# EAGLE board DUINOMITE-eMEGA_Rev_B1 (EAGLE 4.16), part 1 of 2
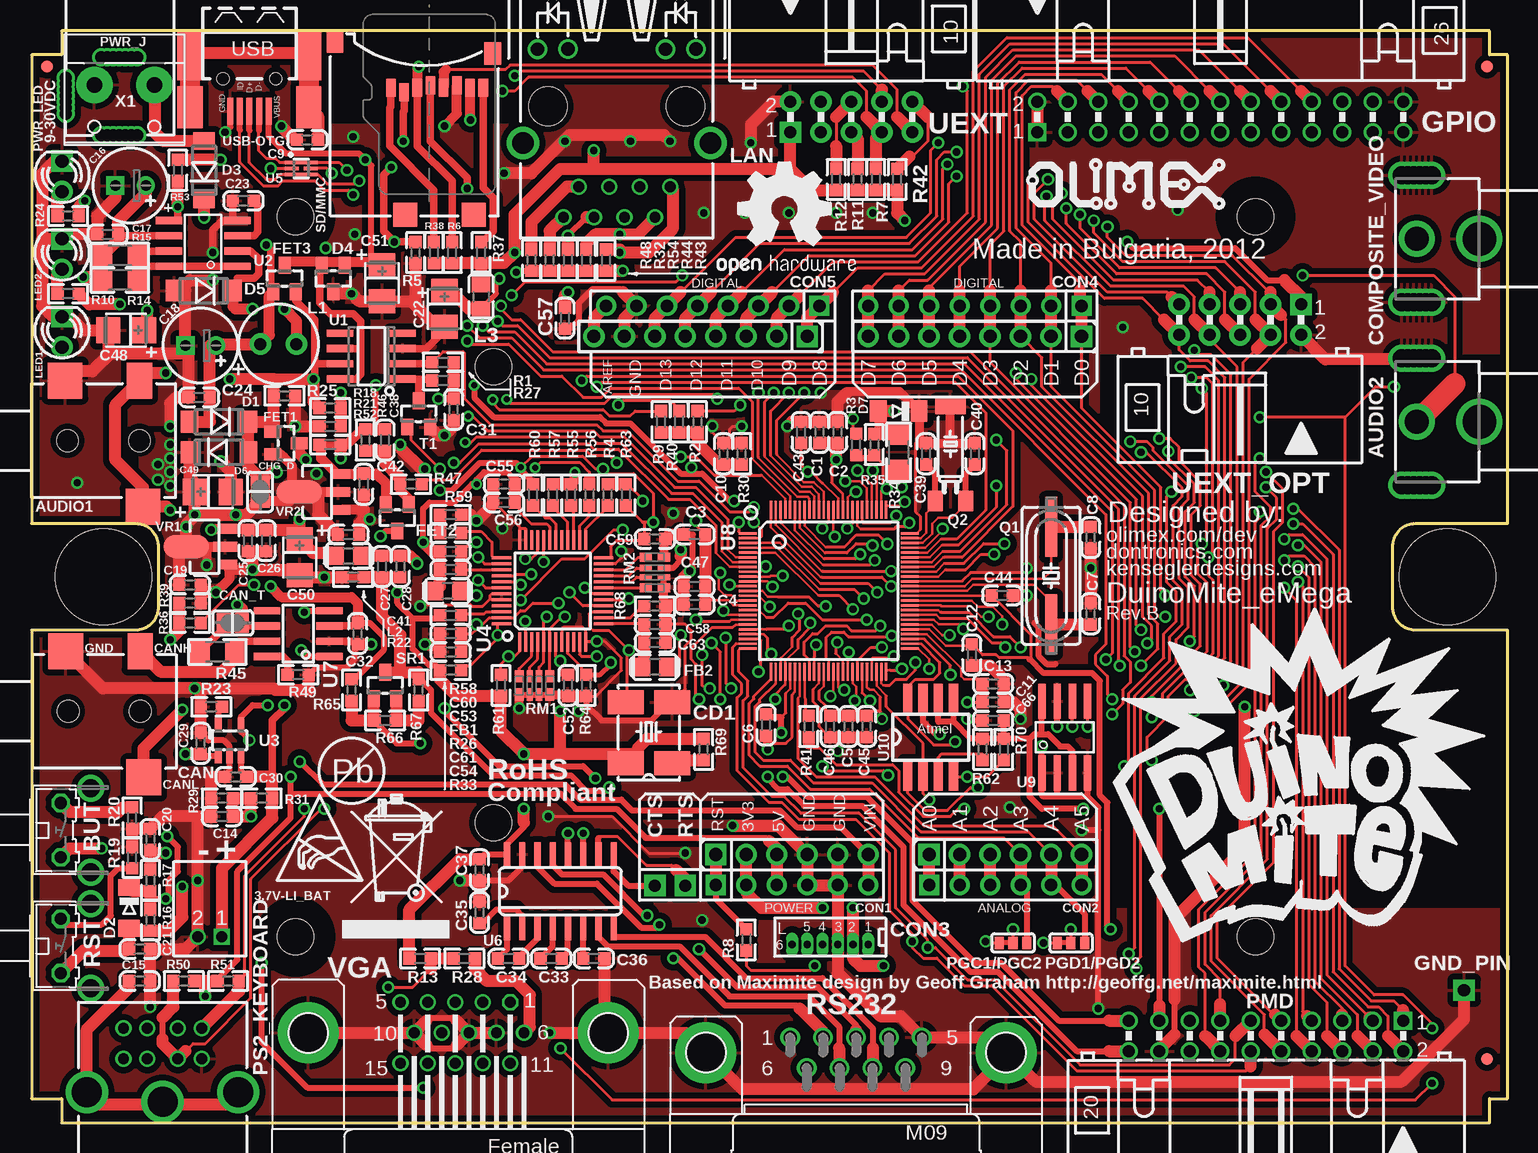
[diagram p2: board, top side]
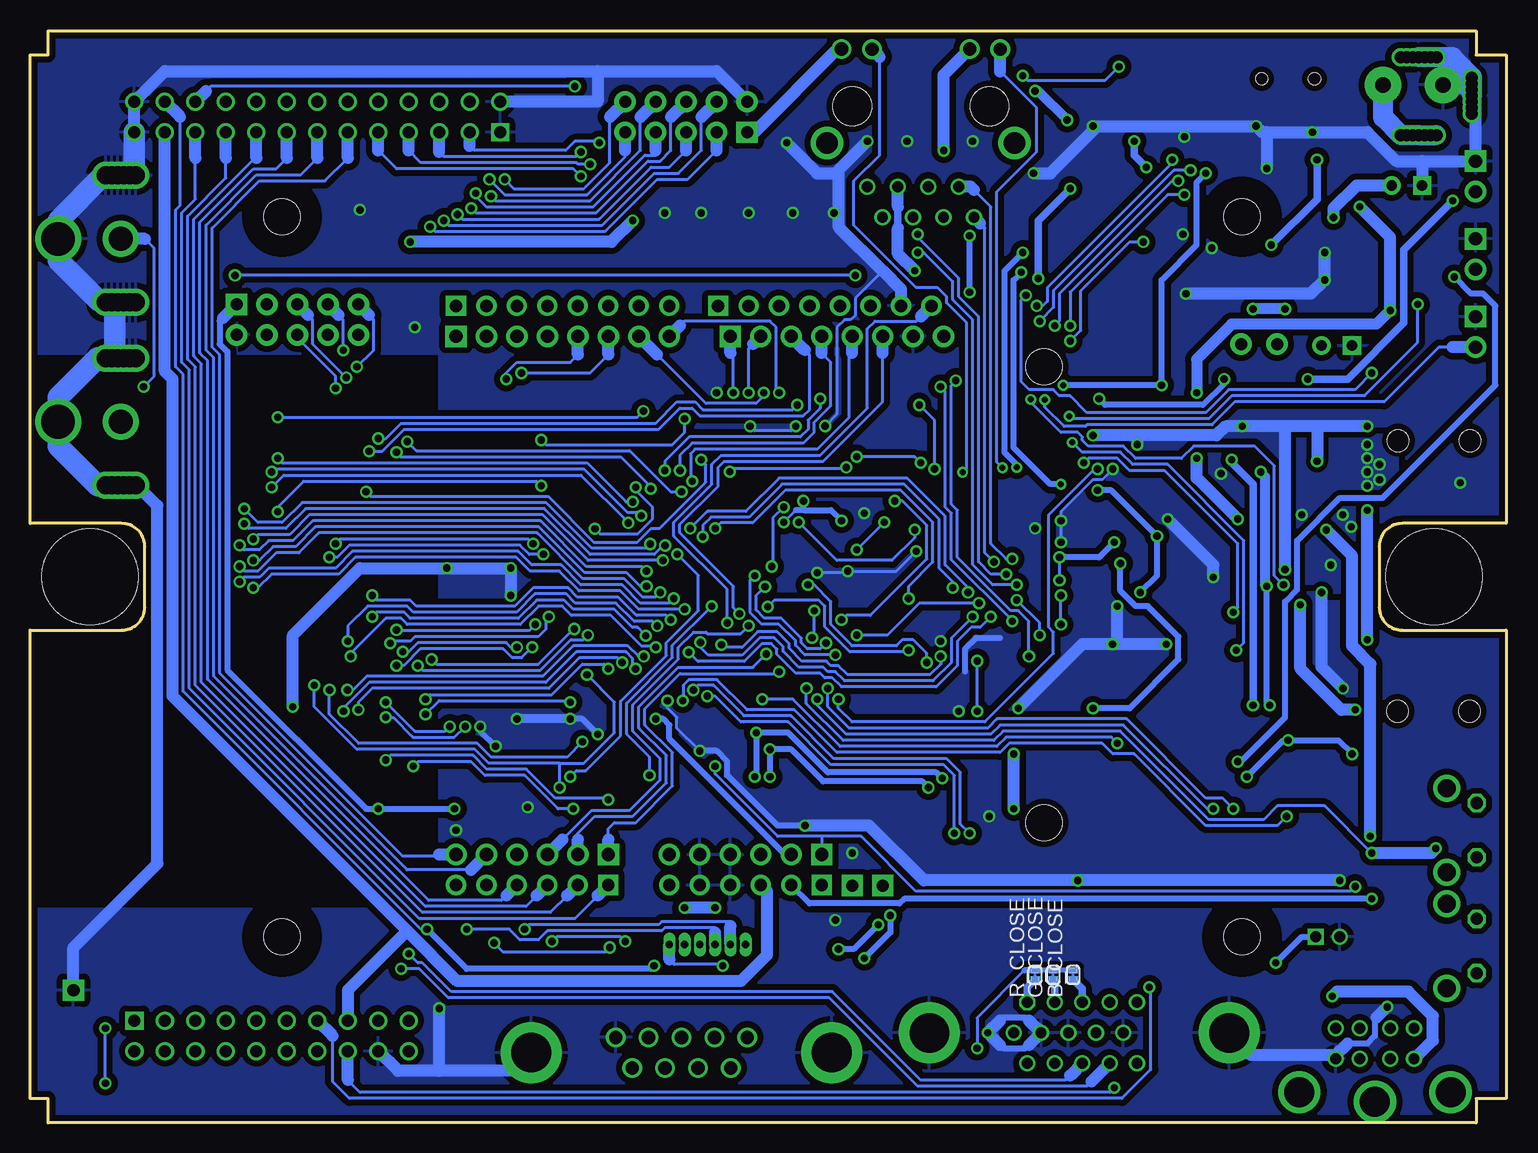
[diagram p3: board, bottom side, seen from below]

Size 123 x 91 mm. Coordinates in mm from the lower left corner, seen from the top.
Copper layers (1+16): Top 0.035mm / dielectric 1.5mm / Bottom 0.035mm
Design rules "default": minimum track width 8mil, minimum drill 0.5mm, track to track 8mil, track to pad 8mil, pad to pad 8mil, via to via 8mil, smd to smd 1mil, copper to edge 10mil, drill to drill 8mil, minimum pad ring 8mil, minimum via ring 8mil, stop-mask expansion 4mil, vias tented up to drill 25mil, thermal gap 20mil
Net classes: 1 pwr: width 0.201 mm, drill 0.201 mm
Holes 3 mm at 38.5,63 38.5,25

## Footprints (pad centres in the part's own frame; a part is rotated, then mirrored left to right if it is on the bottom)
DW02R = drill 0.9 square: 1 -1,0 | drill 0.9 round: 2 1,0
PHONE_JACK-SMD = smd 2.9 x 3: 1 -0.2,5; 5 6.3,-5.5 | smd 2.1 x 3: 2 6,5 | hole 1.8: 0,0; 6,0
VIDEO_CINCH = drill 1.5 pad 1.93 round: GND1 -5.3,-5.475; GND1A -5.3,-3.975; GND1B -5.3,-4.475; GND1C -5.3,-4.975; GND1D -5.3,-5.975; GND1E -5.3,-6.475; GND3 5.3,-5.475; GND3C 5.3,-4.975; GND3D 5.3,-5.975; GND3E 5.3,-6.475; GNG3A 5.3,-3.975; GNG3B 5.3,-4.475 | drill 2.8 round: GND2 0,0 | drill 2 round: IO 0,-5.2
SJ_1_SMALLER_CLOSE = smd 0.508 x 0.762: 1 -0.381,0; 2 0.381,0
B3F-31XX = drill 1.016 octagon: 1 -2.261,-1.245; 2 2.261,-1.245 | drill 1.499 pad 2.159 round: 3 -3.505,1.245; 4 3.505,1.245
C0603_DWS = smd 1.016 x 1.016: 1 -0.889,0; 2 0.889,0
E2,5-6,3 = drill 0.864 pad 1.524 round: + -1.27,0 | drill 0.864 pad 1.524 square: - 1.27,0
CT3528 = smd 2 x 2.2: + -1.5,0; - 1.5,0
C0603_DWS_NA = smd 1.016 x 1.016: 1 -0.889,0; 2 0.889,0
SJ = smd 1.168 x 1.6: 1 -0.762,0; 2 0.762,0
7X5MM_CLOCK_DRIVER = smd 2 x 3: 1 -2.54,-1.941; 2 2.54,-1.941; 3 2.54,1.901; 4 -2.54,1.901
PN1X6 = drill 1.1 pad 1.778 square: 1 -6.35,0 | drill 1.1 pad 1.778 round: 2 -3.81,0; 3 -1.27,0; 4 1.27,0; 5 3.81,0; 6 6.35,0
CON1.27MM-6-SMALL_ICSP = drill 0.6 pad 1.016 long: 1 -3.175,0; 2 -1.905,0; 3 -0.635,0; 4 0.635,0; 5 1.905,0; 6 3.175,0
PN1X8 = drill 1.1 pad 1.778 square: 1 -8.89,0 | drill 1.1 pad 1.778 round: 2 -6.35,0; 3 -3.81,0; 4 -1.27,0; 5 1.27,0; 6 3.81,0; 7 6.35,0; 8 8.89,0
TEST_PAD40/70/SQUARE = drill 1.016 pad 1.778 square: P$1 0,0
MLL-41 = smd 1.45 x 1.8: A 2.445,0; K -2.445,0
MINI-MELF = smd 1.4 x 1.8: A 1.7,0; C -1.7,0
SOT-23 = smd 1 x 1.4: 1 -0.95,-1.1; 2 0.95,-1.1; 3 0,1.1
L0805_5MIL_DWS = smd 1.27 x 1.524: 1 -1.016,0; 2 1.016,0
SOT23 = smd 1 x 1.4: 1 -0.95,-1.1; 2 0.95,-1.1; 3 0,1.1
FIDUCIAL-1X2 = smd 1 x 1: 1 0,0
BH26R = drill 1 square: 1 -15.24,-1.27 | drill 1 round: 2 -15.24,1.27; 3 -12.7,-1.27; 4 -12.7,1.27; 5 -10.16,-1.27; 6 -10.16,1.27; 7 -7.62,-1.27; 8 -7.62,1.27; 9 -5.08,-1.27; 10 -5.08,1.27; 11 -2.54,-1.27; 12 -2.54,1.27; 13 0,-1.27; 14 0,1.27; 15 2.54,-1.27; 16 2.54,1.27; 17 5.08,-1.27; 18 5.08,1.27; 19 7.62,-1.27; 20 7.62,1.27; 21 10.16,-1.27; 22 10.16,1.27; 23 12.7,-1.27; 24 12.7,1.27; 25 15.24,-1.27; 26 15.24,1.27
SW68 = drill 1 pad 1.778 round: 1 -1.5,0; 2 1.5,0
RJLBC-060TC1 = drill 0.9 round: 1 -4.455,6.7; 2 -3.185,9.24; 3 -1.915,6.7; 4 -0.645,9.24; 5 0.625,6.7; 6 1.895,9.24; 7 3.165,6.7; 8 4.435,9.24 | drill 1.1 round: AG 4.07,-4.773; AY -6.61,-4.773; KG 6.61,-4.748; KY -4.07,-4.748 | drill 1.8 round: GND1 -7.8,3.05; GND2 7.8,3.05 | hole 3.2: -5.715,0; 5.715,0
LED-3.0MM = drill 1.092 pad 1.778 round: A -1.27,0 | drill 1.092 pad 1.778 square: K 1.27,0
SJ_2_SMALL_23_TIED = smd 0.762 x 1.016: 1 -1.143,0; 2 0,0; 3 1.143,0
ML20L = drill 1.016 square: 1 -11.43,-1.27 | drill 1.016 round: 2 -11.43,1.27; 3 -8.89,-1.27; 4 -8.89,1.27; 5 -6.35,-1.27; 6 -6.35,1.27; 7 -3.81,-1.27; 8 -3.81,1.27; 9 -1.27,-1.27; 10 -1.27,1.27; 11 1.27,-1.27; 12 1.27,1.27; 13 3.81,-1.27; 14 3.81,1.27; 15 6.35,-1.27; 16 6.35,1.27; 17 8.89,-1.27; 18 8.89,1.27; 19 11.43,-1.27; 20 11.43,1.27
PS2 = drill 0.9 round: 1 1.27,1.77; 2 -1.27,1.77; 3 3.26,1.77; 4 -3.26,1.77; 5 3.26,4.31; 6 -3.26,4.31; NC1 -1.27,4.31; NC2 1.27,4.31 | drill 2.5 round: SHIELD1 -6.3,-1; SHIELD2 0,-1.8; SHIELD3 6.3,-1
PWR_JACK_UNI_MILLING = drill 1 round: + 0,4.75; +1 0,5.25; +2 0,5.75; +3 0,6.25; +4 0,4.25; +5 0,3.75; +6 0,3.25; - -6.5,4.75; -1 -6.5,5.25; -2 -6.5,5.75; -3 -6.5,4.25; -4 -6.5,3.75; -5 -6.5,6.25; -6 -6.5,3.25; -- -3.3,0.3; --1 -3.8,0.3; --2 -4.3,0.3; --3 -4.8,0.3; --4 -2.8,0.3; --5 -2.3,0.3; --6 -1.8,0.3
HC49/SMD2_THIN = smd 5 x 1: 1 -4.064,0; 2 4.064,0
TC26H_3_REPAIR_SMD = smd 1.27 x 1.778: 1 -1.27,0; 2 1.27,0 | smd 2.54 x 1.27: GND 0,7.874
R0603_5MIL_DWS = smd 1.016 x 1.016: 1 -0.889,0; 2 0.889,0
R0603MM = smd 1 x 1: 1 -0.9,0; 2 0.9,0
R1206_5MIL_WS = smd 1.651 x 1.778: 1 -1.46,0; 2 1.46,0
0603_0R = smd 1.016 x 1.016: 1 -0.889,0; 2 0.889,0
R0603_5MIL_DWS_NA = smd 1.016 x 1.016: 1 -0.889,0; 2 0.889,0
R_MATRIX_4 = smd 1.016 x 0.762: 1.1 -0.762,1.27; 1.2 0.762,1.27; 4.1 -0.762,-1.27; 4.2 0.762,-1.27 | smd 1.016 x 0.508: 2.1 -0.762,0.381; 2.2 0.762,0.381; 3.1 -0.762,-0.381; 3.2 0.762,-0.381
DB9-BMR = drill 1.1 round: 1 -5.486,1.27; 2 -2.743,1.27; 3 0,1.27; 4 2.743,1.27; 5 5.486,1.27; 6 -4.115,-1.27; 7 -1.372,-1.27; 8 1.372,-1.27; 9 4.115,-1.27 | drill 3.302 pad 5.08 round: G1 12.522,0; G2 -12.522,0
TFR-MEM-CON = smd 0.8 x 1.5: 1 -3.2,10.7; 2 -2.1,10.3; 3 -1,10.7; 4 0.1,10.9; 5 1.2,10.7; 6 2.3,10.9; 7 3.4,10.7; 8 4.5,10.7 | smd 2 x 2: 9 3.7,0.1; 10 -2,0.1 | smd 1.4 x 1.9: 11 5.3,13.55; 12 -7.85,14.55
SOIC8 = smd 0.6 x 2.2: 1 -1.905,-2.6; 2 -0.635,-2.6; 3 0.635,-2.6; 4 1.905,-2.6; 5 1.905,2.6; 6 0.635,2.6; 7 -0.635,2.6; 8 -1.905,2.6
SO-8_TRM = smd 0.6 x 2.2: 1 -1.905,-2.854; 2 -0.635,-2.854; 3 0.635,-2.854; 4 1.905,-2.854; 5 1.905,2.854; 6 0.635,2.854; 7 -0.635,2.854; 8 -1.905,2.854
SOT-23-5 = smd 0.55 x 1.2: 1 -0.95,-1.3; 2 0,-1.3; 3 0.95,-1.3; 4 0.95,1.3; 5 -0.95,1.3
LQFP48_MM = smd 1.624 x 0.254: 1 -4.25,2.75; 2 -4.25,2.25; 3 -4.25,1.75; 4 -4.25,1.25; 5 -4.25,0.75; 6 -4.25,0.25; 7 -4.25,-0.25; 8 -4.25,-0.75; 9 -4.25,-1.25; 10 -4.25,-1.75; 11 -4.25,-2.25; 12 -4.25,-2.75; 25 4.25,-2.75; 26 4.25,-2.25; 27 4.25,-1.75; 28 4.25,-1.25; 29 4.25,-0.75; 30 4.25,-0.25; 31 4.25,0.25; 32 4.25,0.75; 33 4.25,1.25; 34 4.25,1.75; 35 4.25,2.25; 36 4.25,2.75 | smd 0.254 x 1.624: 13 -2.75,-4.25; 14 -2.25,-4.25; 15 -1.75,-4.25; 16 -1.25,-4.25; 17 -0.75,-4.25; 18 -0.25,-4.25; 19 0.25,-4.25; 20 0.75,-4.25; 21 1.25,-4.25; 22 1.75,-4.25; 23 2.25,-4.25; 24 2.75,-4.25; 37 2.75,4.25; 38 2.25,4.25; 39 1.75,4.25; 40 1.25,4.25; 41 0.75,4.25; 42 0.25,4.25; 43 -0.25,4.25; 44 -0.75,4.25; 45 -1.25,4.25; 46 -1.75,4.25; 47 -2.25,4.25; 48 -2.75,4.25
USBLC6-2P6 = smd 0.3 x 1.46: 1 -0.5,-0.65; 3 0.5,-0.65; 4 0.5,0.65; 6 -0.5,0.65 | smd 0.3 x 1.16: 2 0,-0.8; 5 0,0.8
SO16-150MIL-THIN_PADS = smd 0.508 x 2.032: 1 -4.445,-3.073; 2 -3.175,-3.073; 3 -1.905,-3.073; 4 -0.635,-3.073; 5 0.635,-3.073; 6 1.905,-3.073; 7 3.175,-3.073; 8 4.445,-3.073; 9 4.445,3.073; 10 3.175,3.073; 11 1.905,3.073; 12 0.635,3.073; 13 -0.635,3.073; 14 -1.905,3.073; 15 -3.175,3.073; 16 -4.445,3.073
SO-08 = smd 0.6 x 2.2: 1 -1.905,-2.6; 2 -0.635,-2.6; 3 0.635,-2.6; 4 1.905,-2.6; 5 1.905,2.6; 6 0.635,2.6; 7 -0.635,2.6; 8 -1.905,2.6
PTQFP100 = smd 0.2 x 1.5: 1 -4.8,-6.75; 2 -4.4,-6.75; 3 -4,-6.75; 4 -3.6,-6.75; 5 -3.2,-6.75; 6 -2.8,-6.75; 7 -2.4,-6.75; 8 -2,-6.75; 9 -1.6,-6.75; 10 -1.2,-6.75; 11 -0.8,-6.75; 12 -0.4,-6.75; 13 0,-6.75; 14 0.4,-6.75; 15 0.8,-6.75; 16 1.2,-6.75; 17 1.6,-6.75; 18 2,-6.75; 19 2.4,-6.75; 20 2.8,-6.75; 21 3.2,-6.75; 22 3.6,-6.75; 23 4,-6.75; 24 4.4,-6.75; 25 4.8,-6.75; 51 4.8,6.75; 52 4.4,6.75; 53 4,6.75; 54 3.6,6.75; 55 3.2,6.75; 56 2.8,6.75; 57 2.4,6.75; 58 2,6.75; 59 1.6,6.75; 60 1.2,6.75; 61 0.8,6.75; 62 0.4,6.75; 63 0,6.75; 64 -0.4,6.75; 65 -0.8,6.75; 66 -1.2,6.75; 67 -1.6,6.75; 68 -2,6.75; 69 -2.4,6.75; 70 -2.8,6.75; 71 -3.2,6.75; 72 -3.6,6.75; 73 -4,6.75; 74 -4.4,6.75; 75 -4.8,6.75 | smd 1.5 x 0.2: 26 6.75,-4.8; 27 6.75,-4.4; 28 6.75,-4; 29 6.75,-3.6; 30 6.75,-3.2; 31 6.75,-2.8; 32 6.75,-2.4; 33 6.75,-2; 34 6.75,-1.6; 35 6.75,-1.2; 36 6.75,-0.8; 37 6.75,-0.4; 38 6.75,0; 39 6.75,0.4; 40 6.75,0.8; 41 6.75,1.2; 42 6.75,1.6; 43 6.75,2; 44 6.75,2.4; 45 6.75,2.8; 46 6.75,3.2; 47 6.75,3.6; 48 6.75,4; 49 6.75,4.4; 50 6.75,4.8; 76 -6.75,4.8; 77 -6.75,4.4; 78 -6.75,4; 79 -6.75,3.6; 80 -6.75,3.2; 81 -6.75,2.8; 82 -6.75,2.4; 83 -6.75,2; 84 -6.75,1.6; 85 -6.75,1.2; 86 -6.75,0.8; 87 -6.75,0.4; 88 -6.75,0; 89 -6.75,-0.4; 90 -6.75,-0.8; 91 -6.75,-1.2; 92 -6.75,-1.6; 93 -6.75,-2; 94 -6.75,-2.4; 95 -6.75,-2.8; 96 -6.75,-3.2; 97 -6.75,-3.6; 98 -6.75,-4; 99 -6.75,-4.4; 100 -6.75,-4.8
SO-08MN = smd 0.61 x 2.921: 1 -1.905,-2.981; 2 -0.635,-2.981; 3 0.635,-2.981; 4 1.905,-2.981; 5 1.905,2.981; 6 0.635,2.981; 7 -0.635,2.981; 8 -1.905,2.981
AT45DB041B_1 = smd 0.762 x 2.54: 1 -1.905,-3.175; 2 -0.635,-3.175; 3 0.635,-3.175; 4 1.905,-3.175; 5 1.905,3.175; 6 0.635,3.175; 7 -0.635,3.175; 8 -1.905,3.175
PIC_PLATFORM_MAXMITE_WITHOUT_DIMENSION_LAYER__ICSP = drill 1.016 pad 1.676 round: 3V3 1.27,-24.13; 5V 3.81,-24.13; A1 19.05,-24.13; A2 21.59,-24.13; A3 24.13,-24.13; A4 26.67,-24.13; A5 29.21,-24.13; AREF -10.414,24.13; D1 26.67,24.13; D2 24.13,24.13; D3 21.59,24.13; D4 19.05,24.13; D5 16.51,24.13; D6 13.97,24.13; D7 11.43,24.13; D9 4.826,24.13; D10 2.286,24.13; D11 -0.254,24.13; D12 -2.794,24.13; D13 -5.334,24.13; GND 6.35,-24.13; GND@1 8.89,-24.13; GND@2 -7.874,24.13; VIN 11.43,-24.13 | drill 1.016 pad 1.676 square: A0 16.51,-24.13; D0 29.21,24.13; D8 7.366,24.13; RST -1.27,-24.13
124X91_FREZOVANA = hole 3: -40,30; 40,30; 40,-30; -40,-30 | hole 8: -56,0; 56,0
BH10R = drill 1 pad 1.778 square: 1 -5.08,-1.27 | drill 1 pad 1.778 round: 2 -5.08,1.27; 3 -2.54,-1.27; 4 -2.54,1.27; 5 0,-1.27; 6 0,1.27; 7 2.54,-1.27; 8 2.54,1.27; 9 5.08,-1.27; 10 5.08,1.27
USB_MINI_9PIN = smd 2.25 x 0.5: D+ 2.706,0; D- 2.706,0.8; GND 2.706,-1.6; ID 2.706,-0.8; VBUS 2.706,1.6 | smd 4 x 2.1: GND1 -1.9,4.95; GND3 -1.9,-4.95 | smd 3.5 x 2.1: GND2 2.35,4.95; GND4 2.35,-4.95 | hole 1: 0,2.2; 0,-2.2
DB15-F_22MM = drill 0.9 octagon: 1 4.329,6.35 | drill 0.9 round: 2 2.043,6.35; 3 -0.243,6.35; 4 -2.529,6.35; 5 -4.815,6.35; 6 5.472,3.81; 7 3.186,3.81; 8 0.9,3.81; 9 -1.386,3.81; 10 -3.672,3.81; 11 4.329,1.27; 12 2.043,1.27; 13 -0.243,1.27; 14 -2.529,1.27; 15 -4.815,1.27 | drill 3.302 pad 5.08 round: GND1 -12.497,3.81; GND2 12.497,3.81
SOT89_REP_THERMALOFF = smd 0.8 x 1.4: 1 -1.499,-1.981; 3 1.499,-1.981 | smd 0.8 x 2: 2 0,-1.681 | smd 1.93 x 3.81: P$2 0,1.57
W237-102 = drill 1.27 pad 3.048 round: 1 -2.5,-1.27; 2 2.5,-1.27

## Placement (x,y rotation side)
3.7V-LI_BAT  DW02R  [DW02R]  14.86,15.49 180 top
AUDIO1  JACK-3PINSCJ325P00XG0B02G  [PHONE_JACK-SMD]  3,56.85 0 top
AUDIO2  AUDIO  [VIDEO_CINCH]  120.65,58.42 270 top
B_CLOSE  [SJ_1_SMALLER_CLOSE]  36.07,12.32 90 bottom
BUT  TV-06B  [B3F-31XX]  3.68,24.38 270 top
C1  10uF/6.3V  [C0603_DWS]  65.66,57.53 90 top
C2  100nF  [C0603_DWS]  67.18,57.53 90 top
C3  22uF/6.3V  [C0603_DWS]  55.24,49.02 180 top
C4  22uF/6.3V  [C0603_DWS]  55.24,43.18 180 top
C5  22uF/6.3V  [C0603_DWS]  68.07,33.02 270 top
C6  22uF/6.3V  [C0603_DWS]  61.21,33.15 270 top
C7  39pF  [C0603_DWS]  88.27,42.42 270 top
C8  39pF  [C0603_DWS]  88.27,48.77 90 top
C9  10nF  [C0603_DWS]  22.99,81.92 0 top
C10  10nF  [C0603_DWS]  57.66,55.75 270 top
C11  100nF  [C0603_DWS]  80.14,35.05 180 top
C12  22uF/6.3V  [C0603_DWS]  78.36,38.99 90 top
C13  2.2uF  [C0603_DWS]  80.14,36.58 0 top
C14  10nF  [C0603_DWS]  15.88,25.53 0 top
C15  10nF  [C0603_DWS]  9.02,11.81 0 top
C16  CE 100uF/35V/6.3x11mm/RM2.5  [E2,5-6,3]  8.26,78.11 180 top
C17  100nF  [C0603_DWS]  6.35,74.04 180 top
C18  CE 470uF/10V/6.3x11mm/RM2.5  [E2,5-6,3]  14.1,64.77 180 top
C19  10uF/6.3V  [C0603_DWS]  13.21,44.83 0 top
C20  100nF  [C0603_DWS]  9.91,23.62 90 top
C21  10nF  [C0603_DWS]  9.02,14.48 0 top
C22  47uF/6.3V/tant  [CT3528]  34.42,67.82 270 top
C23  820pF  [C0603_DWS]  17.65,76.83 180 top
C24  10uF/6.3V  [C0603_DWS]  13.97,60.45 180 top
C25  22uF/6.3V  [C0603_DWS]  18.03,48.51 270 top
C26  22uF/6.3V  [C0603_DWS]  19.56,48.51 270 top
C27  10uF/6.3V  [C0603_DWS]  29.21,46.35 270 top
C28  10nF  [C0603_DWS]  30.73,46.35 270 top
C29  2.2uF  [C0603_DWS]  14.1,31.62 90 top
C30  2.2uF  [C0603_DWS]  17.02,28.83 180 top
C31  100nF  [C0603_DWS]  35.18,59.44 270 top
C32  100nF  [C0603_DWS]  27.18,40.77 270 top
C33  100nF  [C0603_DWS]  43.31,13.69 180 top
C34  100nF  [C0603_DWS]  39.75,13.69 180 top
C35  100nF  [C0603_DWS]  37.34,17.53 90 top
C36  100nF  [C0603_DWS]  46.86,13.69 0 top
C37  100nF  [C0603_DWS]  37.34,21.08 270 top
C38  1uF  [C0603_DWS]  29.46,56.9 270 top
C39  27pF  [C0603_DWS]  74.55,55.75 270 top
C40  27pF  [C0603_DWS]  78.61,55.75 270 top
C41  NA(10uF/6.3V)  [C0603_DWS_NA]  26.42,49.02 0 top
C42  NA(10uF/6.3V)  [C0603_DWS_NA]  27.69,53.21 270 top
C43  22uF/6.3V  [C0603_DWS]  64.14,57.53 90 top
C44  22uF/6.3V  [C0603_DWS]  80.9,43.94 0 top
C45  22uF/6.3V  [C0603_DWS]  69.6,33.02 270 top
C46  22uF/6.3V  [C0603_DWS]  66.55,33.02 270 top
C47  22uF/6.3V  [C0603_DWS]  55.24,44.7 180 top
C48  47uF/6.3V/tant  [CT3528]  7.87,66.04 180 top
C49  47uF/6.3V/tant  [CT3528]  15.11,52.58 0 top
C50  47uF/6.3V/tant  [CT3528]  22.35,47.12 270 top
C51  47uF/6.3V/tant  [CT3528]  29.21,69.98 270 top
C52  100nF  [C0603_DWS]  44.7,36.45 270 top
C53  100nF  [C0603_DWS]  34.92,46.1 180 top
C54  100nF  [C0603_DWS]  34.92,39.24 180 top
C55  100nF  [C0603_DWS]  39.37,53.21 180 top
C56  100nF  [C0603_DWS]  39.37,51.69 180 top
C57  100nF  [C0603_DWS]  44.45,67.06 90 top
C58  100nF  [C0603_DWS]  51.94,41.53 0 top
C59  100nF  [C0603_DWS]  51.94,48.64 0 top
C60  10uF/6.3V  [C0603_DWS]  34.92,47.62 180 top
C61  10uF/6.3V  [C0603_DWS]  34.92,40.77 180 top
C63  10uF/6.3V  [C0603_DWS]  51.94,40.01 0 top
C66  100nF  [C0603_DWS]  80.14,33.53 0 top
CAN  JACK-3PINSCJ325P00XG0B02G  [PHONE_JACK-SMD]  3.05,34.29 0 top
CAN_T  Open  [SJ]  16.76,41.66 180 top
CD1  6NC2-50MHz  [7X5MM_CLOCK_DRIVER]  51.44,32.51 90 top
CHG_D  open  [SJ]  19.05,52.58 270 top
COMPOSITE_VIDEO  AUDIO  [VIDEO_CINCH]  120.65,73.66 270 top
CON1  NA  [PN1X6]  63.37,22.35 0 top
CON2  NA  [PN1X6]  81.15,22.35 0 top
CON3  WU06S  [CON1.27MM-6-SMALL_ICSP]  66.55,14.86 180 top
CON4  NA  [PN1X8]  78.61,65.53 180 top
CON5  NA  [PN1X8]  55.75,65.53 180 top
CTS  TESTPAD3  [TEST_PAD40/70/SQUARE]  51.94,19.76 270 top
D1  1N5819S/SS14  [MLL-41]  15.62,58.42 180 top
D2  1N4148/mini-melf  [MINI-MELF]  8.13,17.91 270 top
D3  1N5819S/SS14  [MLL-41]  14.38,79.38 90 top
D4  NA(ESDA6V1L)  [SOT-23]  25.15,70.36 180 top
D5  1N5819S/SS14  [MLL-41]  14.35,69.34 180 top
D6  1N5819S/SS14  [MLL-41]  15.62,55.88 0 top
D7  1N4148/mini-melf  [MINI-MELF]  72.26,59.31 180 top
FB1  FB0805/600R/200mA(201209-601)  [L0805_5MIL_DWS]  34.67,44.32 180 top
FB2  FB0805/600R/200mA(201209-601)  [L0805_5MIL_DWS]  51.94,37.97 180 top
FET1  IRLML6402  [SOT23]  21.21,56.64 270 top
FET2  IRLML6402  [SOT23]  30.48,50.42 180 top
FET3  IRLML6402  [SOT23]  21.08,70.36 0 top
FID1  FIDUCIAL1X2  [FIDUCIAL-1X2]  1.27,88.01 90 top
FID2  FIDUCIAL1X2  [FIDUCIAL-1X2]  121.28,88.01 0 top
FID3  FIDUCIAL1X2  [FIDUCIAL-1X2]  121.28,5.33 0 top
G_CLOSE  [SJ_1_SMALLER_CLOSE]  37.72,12.32 90 bottom
GND_PIN  TESTPAD3  [TEST_PAD40/70/SQUARE]  119.38,11.05 0 top
GPIO  BH26R  [BH26R]  99.06,83.82 0 top
L1  CL10uH SW68  [SW68]  20.57,64.9 180 top
L2  FB0805/600R/200mA(201209-601)  [L0805_5MIL_DWS]  26.42,47.24 0 top
L3  CL470nH/0805/1.76R/250mA  [L0805_5MIL_DWS]  37.47,68.83 270 top
LAN  RJLBC-060TC1  [RJLBC-060TC1]  48.77,84.71 180 top
LED1  3mm-GREEN  [LED-3.0MM]  2.54,65.91 90 top
LED2  3mm-YELLOW  [LED-3.0MM]  2.54,72.39 90 top
PGC1/PGC2  [SJ_2_SMALL_23_TIED]  81.79,14.99 180 top
PGD1/PGD2  [SJ_2_SMALL_23_TIED]  86.61,14.99 180 top
PMD  BH20R  [ML20L]  102.87,7.24 180 top
PS2_KEYBOARD  MD6R MINI-DIN  [PS2]  10.92,3.56 0 top
PWR_J  PWR-JAKPWR_JACK_UNI_MILLING  [PWR_JACK_UNI_MILLING]  2.54,82.3 270 top
PWR_LED  3mm-RED  [LED-3.0MM]  2.54,78.87 90 top
Q1  Q8.000MHz/HC-49SM/20pF/20ppm/SMD  [HC49/SMD2_THIN]  84.96,45.59 270 top
Q2  QCT32768(2x6)/6pF  [TC26H_3_REPAIR_SMD]  76.58,51.82 0 top
R1  10k  [R0603_5MIL_DWS]  34.29,63.37 0 top
R2  100R  [R0603_5MIL_DWS]  55.5,58.42 90 top
R3  1k  [R0603MM]  68.71,56.52 270 top
R4  4.7k  [R0603_5MIL_DWS]  49.53,52.32 90 top
R5  1M/1%  [R0603_5MIL_DWS]  32,72.52 270 top
R6  10k  [R0603_5MIL_DWS]  35.05,72.52 270 top
R7  100k  [R0603_5MIL_DWS]  70.36,78.61 270 top
R8  33R  [R0603_5MIL_DWS]  59.56,15.24 90 top
R9  560R  [R0603_5MIL_DWS]  52.45,58.42 270 top
R10  560R  [R0603_5MIL_DWS]  3.05,69.09 0 top
R11  4.7k  [R0603_5MIL_DWS]  68.83,78.61 270 top
R12  4.7k  [R0603_5MIL_DWS]  67.06,78.61 270 top
R13  100k  [R0603_5MIL_DWS]  32.38,13.69 180 top
R14  0.47R  [R1206_5MIL_WS]  7.37,70.23 0 top
R15  0.47R  [R1206_5MIL_WS]  7.37,72.26 0 top
R16  4.7k  [R0603_5MIL_DWS]  9.91,16.89 270 top
R17  4.7k  [R0603_5MIL_DWS]  9.91,20.19 90 top
R18  NA(3k/1%)  [R0603_5MIL_DWS]  24.89,59.56 0 top
R19  330R  [R0603_5MIL_DWS]  8.38,22.1 270 top
R20  330R  [R0603_5MIL_DWS]  8.38,25.4 90 top
R21  1k/1%  [R0603_5MIL_DWS]  24.89,58.04 180 top
R22  0R(board mounted)  [0603_0R]  26.8,45.47 0 top
R23  15k  [R0603_5MIL_DWS]  14.99,34.67 0 top
R24  330R  [R0603_5MIL_DWS]  3.05,75.56 180 top
R25  10k  [R0603_5MIL_DWS]  21.08,60.58 0 top
R26  10k  [R0603_5MIL_DWS]  34.92,42.29 0 top
R27  10k  [R0603_5MIL_DWS]  34.29,61.85 0 top
R28  10k  [R0603_5MIL_DWS]  36.07,13.69 180 top
R29  470k/1%  [R0603_5MIL_DWS]  15.88,27.05 0 top
R30  47k/1%  [R0603_5MIL_DWS]  59.18,55.75 270 top
R31  1M/1%  [R0603_5MIL_DWS]  19.18,27.05 0 top
R32  49.9R/1%  [R0603_5MIL_DWS]  43.18,71.88 270 top
R33  10k  [R0603_5MIL_DWS]  34.92,37.72 180 top
R34  120R  [R1206_5MIL_WS]  72.26,55.88 90 top
R35  680R  [R0603_5MIL_DWS]  70.23,56.52 90 top
R36  560R  [R0603_5MIL_DWS]  13.21,41.66 180 top
R37  100k  [R0603_5MIL_DWS]  37.47,72.52 270 top
R38  100k  [R0603_5MIL_DWS]  33.53,72.52 270 top
R39  100R  [R0603_5MIL_DWS]  13.21,43.31 0 top
R40  1M/1%  [R0603_5MIL_DWS]  53.98,58.42 90 top
R41  3.3k/1%  [R0603_5MIL_DWS]  64.77,33.02 90 top
R42  100k  [R0603_5MIL_DWS]  72.14,78.61 270 top
R43  49.9R/1%  [R0603_5MIL_DWS]  47.88,71.88 270 top
R44  49.9R/1%  [R0603_5MIL_DWS]  46.23,71.88 270 top
R45  120R  [R1206_5MIL_WS]  15.49,39.24 0 top
R46  100k  [R0603_5MIL_DWS]  27.81,56.9 270 top
R47  10k  [R0603_5MIL_DWS]  31.62,53.21 0 top
R48  49.9R/1%  [R0603_5MIL_DWS]  41.66,71.88 270 top
R49  10k  [R0603_5MIL_DWS]  22.23,37.34 180 top
R50  4.7k  [R0603_5MIL_DWS]  12.7,11.81 180 top
R51  4.7k  [R0603_5MIL_DWS]  16.38,11.81 0 top
R52  0R(board mounted)  [0603_0R]  24.89,56.52 180 top
R53  3.3k/1%  [R0603_5MIL_DWS]  12.19,79.38 270 top
R54  NA  [R0603_5MIL_DWS]  44.7,71.88 270 top
R55  330R  [R0603_5MIL_DWS]  44.96,52.32 270 top
R56  330R  [R0603_5MIL_DWS]  46.48,52.32 270 top
R57  NA  [R0603_5MIL_DWS_NA]  43.43,52.32 270 top
R58  4.99k/1%  [R0603_5MIL_DWS]  34.92,49.15 0 top
R59  1.5K/1%  [R0603_5MIL_DWS]  34.92,50.67 0 top
R60  1k  [R0603_5MIL_DWS]  41.78,52.32 270 top
R61  1k  [R0603_5MIL_DWS]  39.12,36.45 90 top
R62  10k  [R0603_5MIL_DWS]  79.25,31.11 90 top
R63  330R  [R0603_5MIL_DWS]  48.01,52.32 270 top
R64  1k  [R0603_5MIL_DWS]  46.23,36.45 270 top
R65  NA(470R)  [R0603_5MIL_DWS_NA]  26.67,36.07 90 top
R66  NA(15k/1%)  [R0603_5MIL_DWS_NA]  29.46,33.53 180 top
R67  NA(47k/1%)  [R0603_5MIL_DWS_NA]  32.26,36.07 270 top
R68  1k  [R0603_5MIL_DWS]  51.94,43.05 0 top
R69  100k  [R0603_5MIL_DWS]  56.01,31.11 270 top
R70  10k  [R0603_5MIL_DWS]  81.03,31.11 90 top
R_CLOSE  [SJ_1_SMALLER_CLOSE]  39.24,12.32 90 bottom
RM1  1k  [R_MATRIX_4]  41.91,36.45 90 top
RM2  1k  [R_MATRIX_4]  51.94,45.85 180 top
RS232  DB9-MALE  [DB9-BMR]  68.71,5.84 0 top
RST  TV-06B  [B3F-31XX]  3.68,14.73 270 top
RTS  TESTPAD3  [TEST_PAD40/70/SQUARE]  54.48,19.76 270 top
SD/MMC  MICRO  [TFR-MEM-CON]  33.15,75.56 0 top
SR1  NA(AP431SAG-7)  [SOT-23]  29.46,36.45 0 top
T1  DTC114YKA  [SOT-23]  32.26,59.08 0 top
U1  MIC2075-2YM  [SOIC8]  28.32,63.88 90 top
U2  MC33063ADR(SO8)  [SO-8_TRM]  14.3,73.28 90 top
U3  MCP73812T-420I/OT  [SOT-23-5]  16.51,31.88 0 top
U4  KSZ8721BLMM  [LQFP48_MM]  43.43,44.32 90 top
U5  NA(USBLC6-2P6)  [USBLC6-2P6]  22.48,79.53 270 top
U6  ST3232(SO16)  [SO16-150MIL-THIN_PADS]  44.07,19.3 0 top
U7  MCP2551-I/SN  [SO-08]  22.23,40.77 90 top
U8  PIC32MX795F512L-80I/PT  [PTQFP100]  66.42,44.32 270 top
U9  24LC256-I/SN  [SO-08MN]  86.11,32.13 0 top
U10  AT45DB041D-SU  [AT45DB041B_1]  74.93,32.13 0 top
U11  3x(PN1x8)+1x(PN1x6)  [PIC_PLATFORM_MAXMITE_WITHOUT_DIMENSION_LAYER__ICSP]  58.29,43.94 0 top
U$1  [LOGO-OPENHARDWARE_8X8]  62.74,76.07 0 top
U$4  [DUINOMITE1]  90.63,14.83 0 top
U$5  [124X91_FREZOVANA]  62,45.5 180 top
U$17  [OLIMEX1_V]  100.63,75.95 0 top
U$18  [PB]  26.67,29.34 0 top
U$19  [ESD_SYMBOL]  20.45,20.19 0 top
U$21  [RECYCLE_BIN1/4]  25.91,15.37 0 top
UEXT  BH10R  [BH10R]  68.33,83.82 0 top
UEXT_OPT  BH10R  [BH10R]  100.71,66.93 180 top
USB-OTG  USB-OTG  [USB_MINI_9PIN]  18.16,87 270 top
VGA_DB15-F  VGA15  [DB15-F_22MM]  35.56,3.68 0 top
VR1  MCP1700T-3302E/MB  [SOT89_REP_THERMALOFF]  14.48,48.01 90 top
VR2  NA(MCP1700T-3302E/MB)  [SOT89_REP_THERMALOFF]  23.88,52.58 90 top
X1  NA  [W237-102]  7.75,85.22 180 top

## Tracks (layer width: path | path; a pad name or v marks a point on that pad's centre or on a via)
1.8V_CORE  (via drill 0.6)
  Top 0.203: U8.85 67.62,52.39 67.59,52.43
  Top 0.254: 64.77,31.62 65.15,31.24 65.66,31.24 67.06,29.84 71.75,29.84 72.26,29.34 72.26,27.56 74.3,25.53 76.58,25.53 77.22,26.16 v77.72,26.16 | 67.59,52.43 66.67,53.34 66.67,54.86 v67.06,55.24 | v95,52.58 94.61,52.2 94.61,45.03 95.38,44.27 95.38,41.78 94.36,40.77 94.36,38.73 91.44,35.81 91.44,30.1 v91.06,29.72
  Top 1.016: R41.1 64.77,31.62 | C1.1 C2.1 67.06,56.52 v67.06,55.24
  Bottom 0.254: v67.06,55.24 66.67,54.86 66.67,53.39 70.54,49.53 71.25,49.53 72.39,48.39 76.02,48.39 79.83,52.2 94.61,52.2 v95,52.58 | v77.72,26.16 78.99,26.16 81.79,28.96 85.09,28.96 86.23,30.1 90.68,30.1 v91.06,29.72
+5V  (via drill 0.6)
  Top 0.508: v19.68,34.8 18.41,34.8 17.46,33.84 U3.4 17.46,32.58 v18.16,31.88 | U3.1 14.25,30.58 C29.1 | R65.2 26.92,36.96 29.34,39.37 29.34,40.51 28.19,41.66 C32.1 | 21.59,27.43 21.59,25.4 17.14,20.95 17.14,13.59 15.37,11.81 | 61.47,23.5 61.21,23.75 51.18,23.75 48.77,26.16 45.34,26.16 44.07,27.43 21.59,27.43 | 21.59,27.43 v21.59,28.83
  Top 0.61: FET3.2 22.03,68.52 23.62,66.93 23.62,63.25 | 23.62,63.25 U1.7 | 23.62,63.25 23.62,62.1 v23.5,61.98 | U7.3 26.92,41.4 C32.1 | v33.91,60.33 C31.1
  Top 0.762: 18.07,57.94 D1.K
  Top 0.813: CHG_D.1 19.94,54.23 v20.45,54.23 | v19.94,44.7 20.83,43.81 26.67,43.81 27.18,43.31 C32.1
  Top 1.016: 18.07,57.94 D6.A 18.07,54.7 19.05,53.72 CHG_D.1 | 18.03,58.42 D1.K 20.19,58.42 | FET1.1 20.19,57.68 20.19,58.42 | 20.19,58.42 R25.1 20.19,61.98 | R18.1 23.5,60.07 v23.5,61.98 20.19,61.98 | R1.2 R27.2 C31.1 | R24.1 3.94,76.33 v4.45,76.83 | 20.19,61.98 v16.51,61.98 | v12.83,30.73 C29.1 | U11.5V CON1.3 62.1,22.86 61.47,23.5 | 14.48,11.81 R50.1 | 14.48,11.81 15.37,11.81 R51.1 | v14.48,10.54 14.48,11.81
  Bottom 0.508: v23.5,61.98 23.5,61.59 25.27,59.82 33.4,59.82 v33.91,60.33 | v19.68,34.8 19.94,35.05 v19.94,44.7 | v12.83,30.73 13.97,31.88 v18.16,31.88 18.54,31.88 v21.59,28.83
  Bottom 0.61: v4.45,76.83 8.51,72.77 8.51,66.67 13.21,61.98 v16.51,61.98
  Bottom 0.813: v20.45,54.23 20.07,53.85 20.07,44.83 v19.94,44.7
  Bottom 1.016: PS2_KEYBOARD.4 7.63,5.33 6.1,6.86 6.1,8.89 8.13,10.92 14.1,10.92 v14.48,10.54 | GPIO.23 111.76,62.61 111.12,61.98 111.12,35.56 91.57,16 | 91.57,16 87.38,11.81 63.75,11.81 61.59,13.97 61.59,19.3 U11.5V | PMD.15 96.52,11.05 91.57,16
+5V_VBUS  (via drill 0.6)
  Top 0.203: U8.54 74.62,40.72 77.47,37.87 77.47,37.21 77.72,36.96 78.87,36.96 C13.1
  Top 0.254: v39.12,68.07 39.12,67.82 40.01,66.93 40.77,66.93 43.43,64.26 78.23,64.26 91.06,51.44 91.06,38.91 91.57,38.41 91.57,36.7 90.93,36.07 90.93,34.92 v90.04,34.04 | v77.98,35.05 C11.2
  Top 0.508: USB-OTG.VBUS 19.76,82.22 21.21,80.77 27.3,80.77 v27.81,80.26 28.32,79.76 28.32,71.75
  Top 0.61: U1.8 27.05,61.98 27.43,62.36 27.43,64.52 | 27.43,64.52 27.43,66.8 26.8,67.44 24.89,67.44 24,68.33 24,71.75 | 27.43,64.52 U1.6
  Top 0.813: FET3.3 21.08,71.75 24,71.75 24.2,71.75 | 24.2,71.75 D4.2 | 26.1,71.75 D4.1 | 24.2,71.75 26.1,71.75 | C51.+ 28.93,71.75 28.32,71.75 26.1,71.75
  Top 1.016: C11.2 C13.1
  Bottom 0.254: v27.81,80.26 27.81,80.01 38.23,69.6 38.23,68.45 38.61,68.07 v39.12,68.07 | v90.04,34.04 88.9,35.18 78.11,35.18 v77.98,35.05
+24V  (via drill 0.6)
  Top 0.508: v22.35,30.1 24.26,28.19 44.45,28.19 45.72,26.92 49.15,26.92 50.04,26.04 62.36,26.04 63.75,24.64 67.44,24.64 CON1.6
  Top 0.61: 7.24,73.91 U2.6
  Top 1.016: C16.+ 9.53,77.47 7.24,75.18 C17.1 7.24,73.91 7.24,73.6 R15.1 5.97,72.2 5.97,70.29 R14.1 5.84,70.29 5.84,70.48 v4.32,70.48 | v14.38,75.44 D3.K | CON1.6 U11.VIN
  Bottom 0.508: v4.32,70.48 2.92,69.09 1.91,69.09 0.89,68.07 0.89,61.47 10.29,52.07 13.84,52.07 17.4,48.51 17.4,44.45 18.41,43.43 18.41,33.78 22.1,30.1 v22.35,30.1
  Bottom 1.016: v14.38,75.44 14.38,76.17 12.45,78.11 C16.+
A0  (via drill 0.6)
  Top 0.203: U8.23 60.64,40.32 60.78,40.18
  Top 0.254: 60.78,40.18 60.78,37.8 v60.58,37.59
  Top 1.016: U11.A0 CON2.1
  Bottom 0.254: 109.22,80.39 109.22,76.96 110.36,75.82 110.36,63.37 109.73,62.74 109.73,36.2 90.55,17.02 77.6,17.02 75.69,18.92 | v60.58,37.59 60.73,37.44 68.83,37.44 71.75,34.52 71.75,33.15 69.47,30.86 69.47,28.07 72.52,25.02 74.3,25.02 74.8,24.51 74.8,23.62
  Bottom 1.016: 109.22,80.39 GPIO.21 | U11.A0 75.69,18.92 | CON2.1 74.8,23.62
A1  (via drill 0.6)
  Top 0.203: U8.22 61,40.72 61.04,40.69
  Top 0.254: 61.04,40.69 61.34,40.39 61.34,39.37 v61.65,39.06
  Top 1.016: U11.A1 CON2.2
  Bottom 0.254: 106.68,80.39 106.68,78.74 109.86,75.56 109.86,63.63 109.22,62.99 109.22,36.45 90.3,17.53 79.63,17.53 78.23,18.92 | v61.65,39.06 62.76,37.95 68.99,37.95 72.26,34.67 72.26,32.89 69.98,30.61 69.98,28.32 72.77,25.53 75.95,25.53 77.34,24.13 77.34,23.62
  Bottom 1.016: 106.68,80.39 GPIO.19 | U11.A1 78.23,18.92 | CON2.2 77.34,23.62
A2  (via drill 0.6)
  Top 0.203: 61.24,41.12 U8.21
  Top 0.254: 61.24,41.12 62.81,41.12 v63.12,41.43
  Top 1.016: U11.A2 CON2.3
  Bottom 0.254: 104.14,80.39 104.27,80.39 109.35,75.31 109.35,63.88 108.71,63.25 108.71,36.7 90.04,18.03 81.66,18.03 80.77,18.92 | v63.12,41.43 63.78,40.77 66.55,40.77 66.67,40.89 67.69,40.89 68.96,39.62 68.96,38.63 72.77,34.82 72.77,32.64 70.48,30.35 70.48,28.57 73.03,26.04 76.2,26.04 78.61,23.62
  Bottom 1.016: 104.14,80.39 GPIO.17 | CON2.3 78.61,23.62 | U11.A2 80.77,18.92
A3/PGEC2
  Top 0.203: U8.26 61.62,36.98 61.59,36.96
  Top 0.254: 61.59,36.96 60.2,35.56 60.2,35.33 59.82,34.95 59.82,30.61 60.71,29.72 62.99,29.72 64.9,27.81 69.85,27.81 73.91,23.75 81.03,23.75 CON2.4
  Top 0.508: PGC1/PGC2.1 82.93,19.3 U11.A3
  Top 1.016: CON2.4 U11.A3
  Bottom 0.254: 101.6,80.39 102.49,79.5 104.39,79.5 108.84,75.06 108.84,64.14 108.2,63.5 108.2,36.96 89.79,18.54 83.69,18.54 83.31,18.92
  Bottom 1.016: 101.6,80.39 GPIO.15 | U11.A3 83.31,18.92
A4/PGED2
  Top 0.203: U8.27 62.02,36.62 62,36.6
  Top 0.254: 62,36.6 60.71,35.31 60.71,35.08 60.33,34.7 60.33,30.86 60.96,30.23 63.25,30.23 65.15,28.32 70.05,28.32 74.12,24.26 83.06,24.26 CON2.5
  Top 0.508: U11.A4 85.34,19.81 87.76,17.4 PGD1/PGD2.1
  Top 1.016: CON2.5 U11.A4
  Bottom 0.254: 99.06,80.39 100.46,78.99 104.14,78.99 108.33,74.8 108.33,64.39 107.7,63.75 107.7,37.21 91.57,21.08 86.23,21.08
  Bottom 1.016: 99.06,80.39 GPIO.13 | CON2.5 86.23,21.08
A5
  Top 0.203: U8.32 64.02,35.55 63.88,35.41 63.88,35.36
  Top 0.254: 63.88,35.36 63.88,30.35 65.41,28.83 70.28,28.83 74.35,24.77 85.09,24.77 CON2.6
  Top 1.016: CON2.6 U11.A5
  Bottom 0.254: 96.52,80.39 98.42,78.49 103.89,78.49 107.82,74.55 107.82,64.64 107.19,64.01 107.19,37.47 91.95,22.23 89.03,22.23 88.9,22.35
  Bottom 1.016: 96.52,80.39 GPIO.11 | CON2.6 88.9,22.35
AGND  (via drill 0.6)
  Top 0.203: U8.31 63.62,35.91 63.37,35.66
  Top 0.254: 63.37,35.66 63.37,32.13 62.87,31.62 61.47,31.62 61.21,31.88
  Top 0.508: v61.34,31.11 61.21,31.24 61.21,31.88 C6.2 | R67.1 32.38,36.96 33.27,36.07 33.27,34.16 38.48,28.96 44.96,28.96 46.23,27.69 47.88,27.69 v48.13,27.94 | 89.79,5.97 87.12,5.97 80.52,12.57 78.23,12.57 72.64,18.16 72.64,22.99 69.22,26.42 64.39,26.42 62.99,27.81 62.23,27.81 61.34,28.7 v61.34,28.83
  Top 1.016: C27.2 R22.2 | C27.2 C28.2 C27.2 | SR1.3 30.73,37.55 | 30.73,37.55 32.26,37.55 R67.1 | 30.73,37.55 30.73,40.64 29.21,42.16 C27.2 | 89.79,5.97 PMD.20
  Bottom 0.508: v48.13,27.94 48.64,28.45 56.9,28.45 59.56,31.11 v61.34,31.11 v61.34,28.83
AREF  (via drill 0.6)
  Top 0.203: 62.79,36.5 62.82,36.53 U8.29 62.82,38.49 63.88,39.55 63.88,39.6
  Top 0.254: v61.98,35.31 61.98,35.69 62.79,36.5 | 63.88,39.6 63.88,40.26 64.9,41.27 v64.9,41.66
  Top 0.508: 28.51,33.53 30.42,31.62 v32.38,31.62
  Top 1.016: U11.AREF 46.86,67.06 CON5.8 | R65.1 26.67,33.53 R66.2 28.51,33.53 SR1.1
  Bottom 0.254: v32.38,31.62 32.89,32.13 41.66,32.13 42.42,31.37 55.5,31.37 59.44,35.31 v61.98,35.31 | v64.9,41.66 64.9,44.45 69.34,48.9 69.34,50.04 66.17,53.21 66.17,54.86 65.41,55.63 57.15,55.63 53.21,59.56 53.21,66.17 52.58,66.8 49.15,66.8 48.77,67.18
  Bottom 1.016: 48.77,67.18 U11.AREF
BAT  (via drill 0.6)
  Top 0.203: U8.43 68.42,36.61 68.71,36.32 68.71,35.43 68.61,35.33 v68.61,35.18
  Top 1.016: R29.2 R31.1 v18.29,25.53 C14.2 R29.2
  Bottom 0.254: v18.29,25.53 19.05,24.77 25.02,24.77 30.99,30.73 32.77,30.73 33.66,31.62 41.4,31.62 42.16,30.86 55.75,30.86 59.31,34.42 63.25,34.42 65.76,36.93 68.1,36.93 68.58,36.45 68.58,35.2 v68.61,35.18
BUT/LOAD_FW  (via drill 0.6)
  Top 0.203: U8.18 58.01,42.32 v57.66,42.67
  Top 0.254: v58.29,36.2 57.91,36.58 57.91,40.34 v57.84,40.41
  Top 1.016: 9.91,22.48 R17.2 | 9.91,22.48 C20.1 | BUT.2 3.17,22.86 v5.84,22.86 | v11.18,22.48 9.91,22.48
  Bottom 0.254: v11.18,22.48 15.11,26.42 19.05,26.42 20.19,25.27 24.77,25.27 32.13,32.64 41.91,32.64 42.67,31.88 55.24,31.88 58.29,34.92 v58.29,36.2 | v57.84,40.41 57.66,40.59 v57.66,42.67
  Bottom 1.016: v5.84,22.86 6.22,22.48 v11.18,22.48
CAN1RX  (via drill 0.6)
  Top 0.203: U8.8 58.2,46.32 57.02,47.5 57.02,47.55
  Top 0.254: v35.18,54.99 35.69,54.99 37.26,56.57 46.43,56.57 46.86,56.13 48.9,56.13 53.09,51.94 54.86,51.94 57.02,49.78 57.02,47.55
  Top 0.508: U7.4 22.86,42.67 v22.73,42.55
  Bottom 0.254: v22.73,42.55 22.35,42.93 22.35,48.26 28.45,54.36 31.37,54.36 32.38,55.37 34.8,55.37 v35.18,54.99
CAN1TX  (via drill 0.5, 0.6)
  Top 0.203: 57.53,47.68 57.53,47.62 58.43,46.72 U8.7
  Top 0.254: v36.14,56.69 36.17,56.67 36.6,56.67 37.08,57.15 46.61,57.15 47.12,56.64 49.15,56.64 53.34,52.45 55.12,52.45 57.53,50.04 57.53,47.68
  Top 0.508: U7.1 22.99,38.86 v22.48,39.37
  Bottom 0.254: v22.48,39.37 21.84,40.01 21.84,48.51 28.19,54.86 31.11,54.86 32.13,55.88 35.33,55.88 v36.14,56.69
CANH
  Top 0.61: U7.7 17.27,40.13 16.95,39.81 R45.2
  Top 1.016: CAN.2 10.75,37.59 15.88,37.59 16.95,38.67 R45.2
CANL  (via drill 0.6)
  Top 0.61: CAN_T.1 17.78,41.4 U7.6
  Top 1.016: CAN_T.1 17.53,42.8 v17.14,43.18 | CAN.5 9.35,31.19 v12.57,34.42
  Bottom 1.016: v17.14,43.18 17.14,37.85 13.72,34.42 v12.57,34.42
D0  (via drill 0.6)
  Top 0.203: U8.17 60.6,42.72 61.21,42.11 61.27,42.11
  Top 0.254: 87.38,69.34 87.38,69.98 82.55,74.8 82.55,85.6 83.31,86.36 85.09,86.36 85.47,85.98 | 61.27,42.11 61.85,42.11 63.04,43.31 64.52,43.31 65.91,41.91 v69.6,41.91 | v94.49,43.94 94.11,44.32 94.11,52.96 87.5,59.56 CON4.1
  Top 1.016: CON4.1 U11.D0 87.38,68.2 87.38,69.34 | 85.47,85.98 GPIO.4
  Bottom 0.254: v69.6,41.91 69.98,42.29 72.47,42.29 73.99,43.81 77.39,43.81 78.16,44.58 81.08,44.58 82.6,43.05 90.81,43.05 91.31,43.56 94.11,43.56 v94.49,43.94
D1  (via drill 0.6)
  Top 0.203: U8.38 66.42,38.53
  Top 0.254: 84.96,69.34 84.96,71.63 82.04,74.55 82.04,85.85 83.06,86.87 87.12,86.87 88.01,85.98 | 66.42,38.53 66.24,38.71 66.24,40.46 66.67,40.89 67.69,40.89 68.07,40.51 71.6,40.51 v71.68,40.59 | CON4.2 84.96,61.34 93.6,52.7 93.6,42.55 93.98,42.16 v94.49,42.16
  Top 1.016: CON4.2 U11.D1 84.96,69.34 | 88.01,85.98 GPIO.6
  Bottom 0.254: v71.68,40.59 72.36,41.27 72.8,41.27 74.32,42.8 77.72,42.8 78.49,43.56 80.77,43.56 82.3,42.04 91.31,42.04 91.82,42.55 94.11,42.55 v94.49,42.16
D2  (via drill 0.6)
  Top 0.203: U8.58 75.38,42.32 75.67,42.04 75.72,42.04
  Top 0.254: 82.42,69.34 82.42,73.41 81.53,74.3 81.53,86.11 82.8,87.38 89.15,87.38 90.55,85.98 | 75.72,42.04 77.98,42.04 80.01,40.01 80.77,40.01 v81.15,39.62 | CON4.3 84.2,63.75 84.2,61.34 93.09,52.45 93.09,42.34 93.85,41.58 93.85,39.5 v92.46,38.1
  Top 1.016: CON4.3 U11.D2 82.42,69.34 | 90.55,85.98 GPIO.8
  Bottom 0.254: v81.15,39.62 82.04,38.73 82.8,38.73 83.57,39.5 90.47,39.5 91.87,38.1 v92.46,38.1
D3  (via drill 0.6)
  Top 0.203: U8.59 75.56,42.72 75.74,42.55 75.79,42.55
  Top 0.254: 79.88,69.34 79.88,73.15 81.03,74.3 81.03,86.36 82.55,87.88 91.19,87.88 93.09,85.98 | 75.79,42.55 78.13,42.55 80.16,40.51 81.53,40.51 v82.42,39.62 | CON4.4 79.88,63.37 91.57,51.69 91.57,39.62 v91.95,39.24
  Top 1.016: CON4.4 U11.D3 79.88,69.34 | 93.09,85.98 GPIO.10
  Bottom 0.254: v82.42,39.62 82.93,39.62 83.31,40.01 90.68,40.01 91.44,39.24 v91.95,39.24
D4  (via drill 0.6)
  Top 0.203: U8.60 75.75,43.12 75.82,43.05 78.26,43.05 79.15,42.16 v79.76,42.16
  Top 0.254: 77.34,69.34 77.34,71.37 80.52,74.55 80.52,86.61 82.3,88.39 93.22,88.39 95.63,85.98 | v92.99,39.95 93.34,40.31 93.34,41.4 92.58,42.16 92.58,52.2 83.31,61.47 v83.31,61.98
  Top 1.016: CON4.5 U11.D4 77.34,69.34 | 95.63,85.98 GPIO.12
  Bottom 0.254: v79.76,42.16 80.01,41.91 80.01,41.15 80.64,40.51 90.93,40.51 91.31,40.13 92.81,40.13 v92.99,39.95 | v83.31,61.98 83.31,62.48 82.42,63.37 77.98,63.37 77.34,64.01
  Bottom 1.016: 77.34,64.01 CON4.5
D5  (via drill 0.6)
  Top 0.203: U8.61 78.37,43.52 78.89,43 80.11,43 80.9,42.22 v80.9,41.53
  Top 0.254: 74.8,69.34 74.8,69.6 80.01,74.8 80.01,86.87 82.04,88.9 95.25,88.9 98.17,85.98 | v92.46,41.07 92.08,41.45 92.08,51.94 82.04,61.98 v82.04,62.48
  Top 1.016: CON4.6 U11.D5 74.8,69.34 | 98.17,85.98 GPIO.14
  Bottom 0.254: v80.9,41.53 81.41,41.02 92.41,41.02 v92.46,41.07 | 74.8,64.01 76.33,62.48 v82.04,62.48
  Bottom 1.016: 74.8,64.01 CON4.6
D6  (via drill 0.6)
  Top 0.203: U8.91 65.22,52.2 64.85,52.58 64.01,52.58 61.09,55.5 61.09,55.55
  Top 0.254: 72.26,69.34 73.15,70.23 74.68,70.23 79.5,75.06 79.5,87.12 81.79,89.41 97.28,89.41 100.71,85.98 | 61.09,55.55 61.09,60.07 v61.85,60.83
  Top 1.016: CON4.7 U11.D6 72.26,69.34 | 100.71,85.98 GPIO.16
  Bottom 0.254: v61.85,60.83 61.85,60.58 62.48,59.94 66.67,59.94 70.74,64.01
  Bottom 1.016: 70.74,64.01 CON4.7
D7  (via drill 0.6)
  Top 0.203: U8.92 64.82,52.02 64.67,52.17 63.83,52.17 60.58,55.42 60.58,55.47
  Top 0.254: 69.72,69.34 71.12,70.74 74.42,70.74 78.99,75.31 78.99,87.38 81.53,89.92 99.31,89.92 103.25,85.98 | 60.58,55.47 v60.58,60.83
  Top 1.016: CON4.8 U11.D7 69.72,69.34 | 103.25,85.98 GPIO.18
  Bottom 0.254: v60.58,60.83 60.83,61.09 60.83,66.29 61.34,66.8 68.45,66.8 68.83,66.42
  Bottom 1.016: 68.83,66.42 CON4.8
D8  (via drill 0.6)
  Top 0.203: U8.89 66.02,52.57 65.2,53.39 64.36,53.39 62.1,55.65 62.1,55.7
  Top 0.254: 66.8,69.22 68.83,71.25 74.17,71.25 78.49,75.56 78.49,87.63 81.28,90.42 101.35,90.42 105.79,85.98 | 62.1,55.7 62.1,58.55 v64.39,60.83
  Top 1.016: CON5.1 64.64,67.06 U11.D8 66.8,69.22 | 105.79,85.98 GPIO.20
  Bottom 0.254: v64.39,60.83 64.39,63.88 64.64,64.14
  Bottom 1.016: 64.64,64.14 CON5.1
D9  (via drill 0.6)
  Top 0.203: U8.90 65.62,52.39 65.02,52.98 64.19,52.98 61.59,55.58 61.59,55.63
  Top 0.254: 64.01,68.96 66.8,71.75 73.91,71.75 77.98,75.82 77.98,85.98 v77.6,86.36 | 61.59,55.63 61.59,59.31 v63.12,60.83
  Top 1.016: CON5.2 62.1,67.06 U11.D9 64.01,68.96
  Bottom 0.254: 108.33,85.98 107.95,86.36 v77.6,86.36 | v63.12,60.83 63.12,64.52 62.74,64.9
  Bottom 1.016: 108.33,85.98 GPIO.22 | 62.74,64.9 CON5.2
D10  (via drill 0.6)
  Top 0.203: U8.34 64.82,38.56 64.8,38.58
  Top 0.254: 61.72,69.22 64.77,72.26 73.66,72.26 76.45,75.06 76.45,78.23 v77.09,78.87 | v70.74,41.4 70.36,41.02 68.33,41.02 67.94,41.4 66.17,41.4 65.53,40.77 65.1,40.77 64.39,40.06 64.39,38.99 64.8,38.58 | v94.74,55.96 94.74,55.4 96.9,53.24 96.9,51.69 96.14,50.93 96.14,45.49 96.9,44.73 96.9,40.51 v96.52,40.13
  Top 1.016: CON5.3 59.56,67.06 U11.D10 61.72,69.22
  Bottom 0.254: v77.09,78.87 77.72,79.5 92.46,79.5 93.98,81.03 | 58.42,64.39 58.04,64.01 58.04,59.44 58.55,58.93 67.18,58.93 67.82,59.56 68.83,59.56 70.61,57.78 91.82,57.78 93.65,55.96 v94.74,55.96 | v70.74,41.4 71.12,41.78 72.64,41.78 74.17,43.31 77.55,43.31 78.31,44.07 80.92,44.07 82.45,42.55 91.06,42.55 91.57,43.05 94.87,43.05 96.52,41.4 v96.52,40.13
  Bottom 1.016: 93.98,81.03 GPIO.9 | 58.42,64.39 CON5.3
D11  (via drill 0.6)
  Top 0.203: U8.79 70.02,53.17 v68.83,54.36
  Top 0.254: 59.18,69.22 62.74,72.77 73.41,72.77 75.95,75.31 75.95,79.5 v76.33,79.88
  Top 1.016: CON5.4 57.02,67.06 U11.D11 59.18,69.22
  Bottom 0.254: v76.33,79.88 77.34,79.88 77.47,80.01 90.42,80.01 91.44,81.03 | v68.83,54.36 68.83,55.63 67.82,56.64 58.55,56.64 57.66,57.53 57.66,58.37 56.26,59.77 56.26,63.37 57.02,64.14
  Bottom 1.016: 91.44,81.03 GPIO.7 | 57.02,64.14 CON5.4
D12  (via drill 0.6)
  Top 0.203: v67.82,53.47 69.01,53.47 69.62,52.86 U8.80
  Top 0.254: 56.64,69.22 60.71,73.28 73.15,73.28 75.44,75.56 75.44,80.26 76.07,80.9 v77.09,80.9
  Top 1.016: CON5.5 54.48,67.06 U11.D12 56.64,69.22
  Bottom 0.254: v77.09,80.9 77.47,80.52 88.52,80.52 88.9,80.9 | 54.48,64.14 54.74,63.88 54.74,58.8 57.4,56.13 67.56,56.13 67.94,55.75 67.94,53.59 v67.82,53.47
  Bottom 1.016: 88.9,80.9 GPIO.5 | 54.48,64.14 CON5.5
D13  (via drill 0.6)
  Top 0.203: U8.28 62.42,38.72 63.37,39.67 63.37,39.73
  Top 0.254: 54.1,69.22 58.67,73.79 72.9,73.79 74.93,75.82 74.93,81.03 v75.56,81.66 | 63.37,39.73 63.37,40.44 64.01,41.07 64.01,41.99 63.88,42.11 v63.88,42.42
  Top 1.016: CON5.6 51.94,67.06 U11.D13 54.1,69.22
  Bottom 0.254: v75.56,81.66 75.69,81.79 77.6,81.79 78.36,81.03 85.98,81.03 86.36,81.41 | v63.88,42.42 64.39,42.93 64.39,44.7 68.83,49.15 68.83,49.89 65.66,53.06 65.66,54.61 65.15,55.12 56.9,55.12 51.94,60.07 51.94,64.14
  Bottom 1.016: 86.36,81.41 GPIO.3 | 51.94,64.14 CON5.6
D+  (via drill 0.6)
  Top 0.203: U8.57 75.2,41.92 75.59,41.53 77.27,41.53 v77.65,41.15
  Top 0.254: U5.4 23.84,79.03 24.64,78.23 27.05,78.23 v27.3,78.49 | v37.59,66.42 38.1,65.91 40.26,65.91 42.93,63.25 77.72,63.25 90.04,50.93 90.04,39.12 v89.53,38.61
  Bottom 0.254: v27.3,78.49 27.81,78.49 37.21,69.09 37.21,66.8 v37.59,66.42 | v77.65,41.15 77.72,41.15 80.64,38.23 89.15,38.23 v89.53,38.61
D-  (via drill 0.6)
  Top 0.203: U8.56 75.01,41.52 75.89,40.64 v76.5,40.64
  Top 0.254: U5.6 25.64,80.03 v26.29,79.38 | v38.86,66.8 39.24,66.42 40.51,66.42 43.18,63.75 77.98,63.75 90.55,51.18 90.55,38.2 v90.68,38.08
  Bottom 0.254: v26.29,79.38 27.69,79.38 37.72,69.34 37.72,67.94 v38.86,66.8 | v76.5,40.64 76.89,40.26 77.93,40.26 80.47,37.72 90.32,37.72 v90.68,38.08
DTE_CTS
  Top 0.508: U6.8 48.51,15.62 48.64,15.49 56.13,15.49 59.56,12.06 65.91,12.06 70.1,7.87 70.1,6.22 | 70.1,4.57 RS232.8
  Top 1.016: 70.1,6.22 70.1,4.57
DTE_RTS
  Top 0.508: U6.7 47.24,15.49 48.03,14.71 54,14.71 58.17,10.54 64.77,10.54 67.31,8 67.31,6.22 | 67.31,4.57 RS232.7
  Top 1.016: 67.31,6.22 67.31,4.57
DTE_RXD  (via drill 0.6)
  Top 0.508: U6.13 43.43,21.46 44.2,20.7 47.62,20.7 51.05,17.27 v51.31,17.27 | 64.01,9.53 63.75,9.78 57.78,9.78 53.85,13.72 v53.47,13.72
  Top 1.016: RS232.2 65.96,7.57 64.01,9.53
  Bottom 0.508: v51.31,17.27 51.31,15.88 v53.47,13.72
DTE_TXD  (via drill 0.6)
  Top 0.508: U6.14 42.16,21.34 43.56,19.94 47.12,19.94 50.8,16.26 52.07,16.26 v52.32,16.51 | v55.63,14.48 58.8,11.3 65.53,11.3 68.71,8.13 68.71,7.75
  Top 1.016: 68.71,7.75 RS232.3
  Bottom 0.508: v52.32,16.51 54.36,14.48 v55.63,14.48
EMDC  (via drill 0.6)
  Top 0.203: U8.71 74.65,47.52 75.77,48.64 75.82,48.64
  Top 0.254: U4.2 41.18,41.75 v41.15,41.78 | v47.12,61.34 47.5,61.72 76.96,61.72 79.5,59.18 79.5,51.05 77.09,48.64 75.82,48.64
  Bottom 0.254: v41.15,41.78 41.15,41.86 46.23,46.94 46.23,50.8 46.74,51.31 46.74,60.96 v47.12,61.34
EMDIO  (via drill 0.6)
  Top 0.203: U8.68 75.2,46.32 76,47.12 76.05,47.12
  Top 0.254: U4.1 40.68,39.29 40.26,38.86 v39.75,38.86 39.12,38.23 R61.2 | v45.85,61.85 46.23,62.23 77.22,62.23 81.79,57.66 81.79,51.36 77.55,47.12 76.05,47.12
  Bottom 0.254: v39.75,38.86 39.75,41.78 40.64,42.67 41.27,42.67 45.72,47.12 45.72,51.05 46.23,51.56 46.23,61.47 v45.85,61.85
ERXD0  (via drill 0.6)
  Top 0.203: U8.41 67.62,38.5 67,39.12
  Top 0.254: v44.45,42.16 44.2,42.16 43.18,41.15 U4.6 RM1.4.2 | v67.13,40.03 67,39.9 67,39.12
  Bottom 0.254: v44.45,42.16 46.23,40.39 46.23,38.35 47.75,36.83 55.12,36.83 55.88,37.59 56.52,37.59 56.9,37.97 58.93,37.97 60.25,39.29 60.25,39.67 60.98,40.41 62.2,40.41 63.65,38.96 66.47,38.96 67.13,39.62 v67.13,40.03
ERXD1  (via drill 0.6)
  Top 0.203: U8.42 68.02,39.14 v68.1,39.22
  Top 0.254: v42.93,42.16 42.68,41.92 U4.5 42.68,38.37 42.29,37.97 RM1.3.2
  Bottom 0.254: v42.93,42.16 43.81,41.27 44.58,41.27 45.72,40.13 45.72,38.1 47.5,36.32 55.37,36.32 56.13,37.08 56.77,37.08 57.15,37.47 59.18,37.47 60.76,39.04 60.76,39.47 61.21,39.93 62,39.93 63.48,38.46 67.33,38.46 v68.1,39.22
ERXDV  (via drill 0.6)
  Top 0.203: U8.12 58.27,44.72 v58.17,44.83
  Top 0.254: U4.9 44.68,39.11 45.85,37.95 45.85,37.72 R64.1
  Top 0.406: R64.1 47.37,37.34 48.26,38.23 v48.26,38.35
  Bottom 0.254: v48.26,38.35 48.26,39.12 49.4,40.26 50.29,40.26 50.8,39.75 54.48,39.75 56.26,41.53 56.26,43.43 57.66,44.83 v58.17,44.83
ERXERR  (via drill 0.6)
  Top 0.203: 65.22,38.82 U8.35
  Top 0.254: U4.11 45.68,39.02 45.85,38.86 v47.12,38.86 | 65.22,38.82 65.22,39.67 v65.38,39.83
  Bottom 0.254: v47.12,38.86 47.12,38.23 48.01,37.34 54.86,37.34 55.63,38.1 56.26,38.1 56.64,38.48 58.67,38.48 59.74,39.55 59.74,39.93 60.73,40.92 62.36,40.92 63.65,39.62 65.18,39.62 v65.38,39.83
ETXD0  (via drill 0.6)
  Top 0.203: v65.89,49.53 66.42,50.06 U8.88
  Top 0.254: U4.17 49.67,43.57 v49.78,43.69
  Bottom 0.254: v49.78,43.69 49.78,44.7 47.75,46.74 47.75,50.04 50.42,52.7 60.07,52.7 62.79,49.99 65.43,49.99 v65.89,49.53
ETXD1  (via drill 0.6)
  Top 0.203: U8.87 66.82,48.95 v66.93,48.84
  Top 0.254: U4.18 46.6,44.07 v46.1,44.58
  Bottom 0.254: v46.1,44.58 46.1,45.09 47.24,46.23 47.24,50.29 50.16,53.21 60.33,53.21 63.07,50.47 66.24,50.47 66.93,49.78 v66.93,48.84
ETXEN  (via drill 0.6)
  Top 0.203: U8.83 68.42,49.98 v67.97,49.53
  Top 0.254: U4.16 45.95,43.07 v44.83,44.2
  Bottom 0.254: v44.83,44.2 44.83,44.58 46.74,46.48 46.74,50.55 49.91,53.72 60.58,53.72 63.35,50.95 66.55,50.95 v67.97,49.53
GND  (via drill 0.6)
  Top 0.203: U8.36 65.62,36.61 65.15,36.14 | U8.15 58.71,43.52 58.29,43.94 57.78,43.94 57.28,44.45 57.28,45.72 v57.4,45.85 | U4.12 46.18,41.01 45.92,41.27 | 69.22,35.83 U8.45 | U8.75 73.76,49.12 74.04,49.4 | U8.65 77.53,45.12 77.57,45.16
  Top 0.254: v19.94,79.53 U5.2 | U4.39 37.49,46.07 37.47,46.1 C53.1 35.79,46.07 | U4.35 41.18,49.49 41.15,49.53 40.77,49.53 | U4.36 40.68,49.45 40.77,49.53 | C56.2 38.73,51.44 38.86,51.44 40.77,49.53 | U4.44 38.34,43.57 38.23,43.69 | U4.43 38.36,44.07 38.23,43.94 38.23,43.69 | 38.23,43.69 37.59,43.05 36.7,43.05 36.58,43.18 32.51,43.18 v32.38,43.05 | C60.1 35.94,47.62 36.7,48.39 v37.08,48.39 | U4.12 47.06,40.07 v47.12,40.13 47.75,40.13 49.15,38.73 49.15,37.69 47.02,35.56 R64.2 | U4.8 44.18,41.14 44.32,41.27 45.92,41.27 | U4.23 48.66,46.57 49.15,47.07 v49.15,47.62 | CD1.2 54.48,36.16 54.48,39.75 54.99,40.26 54.99,41.02 54.48,41.53 C58.2 | 65.15,36.14 65.15,35.08 65.66,34.57 65.66,33.02 C46.2 | v67.18,30.99 67.18,32.13 | v69.88,35.18 69.22,35.83 | 58.17,56.64 58.17,57.78 58.42,58.04 v59.18,58.04 | v56.74,58.06 56.74,57.56 C10.1 | 74.04,49.4 74.04,50.55 73.66,50.93 73.66,56.64 C39.1 | 77.57,45.16 78.26,45.85 82.55,45.85 v82.93,46.23 | v54.48,22.48 51.44,22.48 48.39,25.53 v43.05,25.53
  Top 0.508: USB-OTG.GND 16.56,82.98 v16.13,82.55 | C29.2 14.73,31.88 16,31.88 16.51,31.37 U3.2 16.51,29.21 C30.2 | 54.23,49.02 55.12,49.02 55.12,46.23 v54.86,45.97 | 32.9,6.48 33.16,6.22 35.18,6.22 35.43,6.48 35.44,6.48 | 32.89,8.5 33.16,8.76 35.18,8.76 35.43,8.51 | U6.15 40.89,21.34 39.75,20.19 C37.2 | C57.1 44.83,66.17 45.59,66.93 45.59,68.33 46.74,69.47 49.02,69.47 49.28,69.22 | R49.1 23.75,37.97 26.29,37.97 26.92,38.61 26.92,39.62 C32.2 | R64.2 46.23,34.8 47.5,33.53 51.69,33.53 53.21,35.05 CD1.2 | v77.98,33.66 78.11,33.53 C66.1 | v75.69,32.38 75.31,32.38 74.3,33.4 U10.7 | RM2.1.1 RM2.2.1 | 85.47,27.18 84.33,27.18 84.2,27.3 U9.1 v84.2,31.37 | 85.47,27.18 U9.2 | v85.47,33.02 U9.7 | RM1.1.1 RM1.2.1 RM1.3.1 RM1.4.1 43.31,35.56 | 88.01,27.18 85.47,27.18 | 88.01,27.18 88.9,26.29 88.9,24.38 | v88.9,9.53 88.9,24.38 | 88.01,27.18 U9.4 | 95.25,7.37 95.25,10.29 | 83.57,41.66 83.95,41.27 83.95,38.86 84.58,38.23 85.34,38.23 | 88.9,24.38 v87.5,24.38
  Top 0.61: 16.76,75.18 U2.4 | 16.76,75.18 C23.2 | 16.76,75.18 15.88,75.18 15.11,74.42 v15.11,72.52 | U7.2 26.92,40.13 C32.2 | U1.3 32.89,64.52 34.42,66.04 C22.-
  Top 0.762: RM2.1.1 52.7,43.31 52.83,43.18 | RM2.4.1 52.7,48.51 C59.2 | 67.94,60.83 68.07,60.96 72.31,60.96 D7.C 73.96,56.64 C39.1 76.58,56.64 | 76.58,56.64 C40.1 | 76.58,56.64 Q2.GND | v40.64,34.54 RM1.1.1 | RM1.4.1 44.7,35.69 C52.2
  Top 0.813: 27.69,51.08 C42.2 | 27.69,51.08 VR2.1 | 27.69,51.08 | 17.53,46.1 17.45,46.1 | 17.53,46.1 v18.41,46.1 | SD/MMC.6 35.45,84.09 v34.42,83.06 | VR1.1 16.46,46.1 16.51,46.1 | 16.51,46.1 17.53,46.1 | v15.37,44.2 16.51,45.34 16.51,46.1
  Top 0.914: 25.15,69.09 D4.3 | C51.-
  Top 1.016: C16.- 6.99,77.09 5.46,75.56 C17.2 2.92,74.04 LED2.K 0.89,73.66 | AUDIO1.1 3.56,62.61 5.08,62.61 6.6,64.14 | 0.89,73.66 0.89,68.07 1.78,67.18 LED1.K 3.17,67.18 4.32,66.04 C48.- 6.37,64.14 6.6,64.14 | 0.89,73.66 0.89,79.12 1.91,80.14 PWR_LED.K | 18.41,47.62 C26.2 | 18.41,47.62 C25.2 | C18.- 13.08,64.52 C24.2 12.06,60.45 11.56,59.94 v11.56,58.04 | C18.- 12.83,64.14 6.6,64.14 | 34.04,39.88 C54.2 | 34.04,39.88 C61.2 | C49.- 16.61,54.25 v15.75,55.12 | 18.41,47.62 v18.41,46.1 21.87,46.1 C50.- 22.5,45.47 v24.38,45.47 R22.1 | 12.83,69.34 D5.A | 12.83,69.34 12.83,69.85 13.21,70.23 v15.11,70.23 | C18.- 12.83,69.34 | R25.2 v21.97,58.04 R21.2 | v20.83,83.06 21.97,81.92 C9.1 | 31.62,68.45 32,68.45 R5.2 | CAN.1 5.94,36.2 v13.59,36.2 14.1,36.2 | 14.1,44.2 R39.2 | 14.1,44.2 C19.2 | 31.62,68.45 31.6,68.48 C51.- 27.28,68.48 v26.67,69.09 25.15,69.09 | C22.- 33.76,66.32 31.62,68.45 | C29.2 R23.1 14.1,36.2 | C55.2 C56.2 38.48,51.56 v37.08,50.16 36.58,50.67 R59.2 | C52.2 R64.2 | C63.2 C58.2 R68.2 52.83,43.18 C4.2 C47.2 54.36,45.47 v54.86,45.97 | C3.2 54.23,49.02 53.21,49.02 C59.2 | CON5.7 49.4,67.06 U11.GND@2 49.28,69.22 | U11.GND@1 CON1.5 | U11.GND@1 U11.GND CON1.4 62.23,24.77 v58.42,24.77 | C60.1 C53.1 | 27.69,50.29 27.69,51.08 | v28.19,50.29 27.69,50.29 | C41.2 27.3,49.91 27.69,50.29 | T1.2 33.91,57.28 v34.42,57.28 35.18,58.04 C31.2 | 14.1,36.2 20.19,36.2 20.32,36.07 23.11,36.07 R49.1 | 12.45,14.48 C21.2 C15.2 v9.91,9.65 | R19.1 R20.1 C20.2 10.92,25.53 13.84,25.53 | C30.2 14.99,28.83 R29.1 C14.1 13.84,25.53 | 13.84,15.51 3.7V-LI_BAT.2 | 13.84,15.51 v13.84,20.19 13.84,25.53 | 12.45,14.48 12.46,14.48 | 13.84,15.51 12.81,14.48 12.45,14.48
  Top 1.016: C32.2 v28.32,39.88 | v32.79,39.88 34.04,39.88 | VGA_DB15-F.10 32.9,6.48 | 35.44,6.48 VGA_DB15-F.8 VGA_DB15-F.7 | VGA_DB15-F.10 32.89,8.5 | 35.43,8.51 36.45,7.49 | VGA_DB15-F.GND1 VGA_DB15-F.10 | v43.18,7.49 47.75,7.49 | RS232.G1 81.38,5.69 78.49,2.79 59.23,2.79 RS232.G2 54.53,7.49 48.26,7.49 | 48.26,7.49 VGA_DB15-F.GND2 | 47.75,7.49 48.26,7.49 | 47.75,7.49 C36.2 | RS232.G1 79.96,7.11 RS232.5 72.42,8.89 70.74,8.89 67.18,12.45 CON3.3 U11.GND@1 | v59.94,81.66 59.94,83.19 61.85,85.09 UEXT.2 | GPIO.2 GPIO.1 | v35.69,20.19 C37.2 C35.2 | v53.21,81.79 52.7,82.3 44.83,82.3 41.66,79.12 v39.37,79.12 | C46.2 67.18,32.13 C5.2 C45.2 | C12.1 79.88,38.1 81.03,36.96 C13.2 C11.1 81.79,35.05 82.42,34.42 v82.42,33.66 | UEXT_OPT.2 107.82,63.63 114.08,63.63 AUDIO2.GND1E | GND_PIN.P$1 119.38,8.64 114.17,3.43 83.69,3.43 81.28,5.84 RS232.G1 | C10.1 58.17,56.64 R30.1 | v62.99,58.04 63.37,58.42 C43.2 C1.2 C2.2 67.18,60.07 67.94,60.83 | C8.1 v88.27,46.23 C7.1 | v32.77,54.48 32.51,54.48 30.73,56.26 v30.73,56.52 | v82.93,43.94 C44.2 | v101.09,34.67 101.09,22.86 95.25,17.02 95.25,10.29 | PMD.18 93.98,6.1 95.25,7.37 | v15.37,44.2 14.1,44.2
  Bottom 0.254: v37.08,48.39 v37.08,50.16 37.08,50.93 34.42,53.59 33.66,53.59 v32.77,54.48 | v49.15,47.62 50.8,45.97 v54.86,45.97 54.99,45.85 v57.4,45.85 | v67.18,30.99 69.09,32.89 69.09,33.78 69.88,34.57 v69.88,35.18 | v59.18,58.04 59.56,57.66 62.61,57.66 v62.99,58.04 | v56.74,58.06 55.75,59.05 55.75,66.29 55.12,66.93 54.61,66.93 54.23,67.31 54.23,68.71 51.94,70.99
  Bottom 0.508: 13.21,6.6 11.56,6.6 10.92,7.24 10.92,8.64 10.79,8.76 | 39.76,8.51 40.02,8.76 41.91,8.76 42.16,8.51 | 39.75,6.48 40.01,6.22 41.91,6.22 42.16,6.48 | v75.69,32.38 76.96,33.66 v77.98,33.66 | v85.47,33.02 85.47,32.64 v84.2,31.37 | v58.42,24.77 60.71,24.77 64.9,28.96 64.9,30.1 65.79,30.99 v67.18,30.99 | 45.09,37.59 45.09,39.5 44.2,40.39 42.16,40.39
  Bottom 0.762: v77.98,33.66 v82.42,33.66